# EasyEDA schematic 1-Schematic_1-Optimised-IRT-Gr4-ColleJoulian.json
TITLE: Ethernet-RJ45-tester; REV: 1.0; Date: 2023-11-09; Sheet: 1/1; Drawn By: collejoulian; Company: HEH
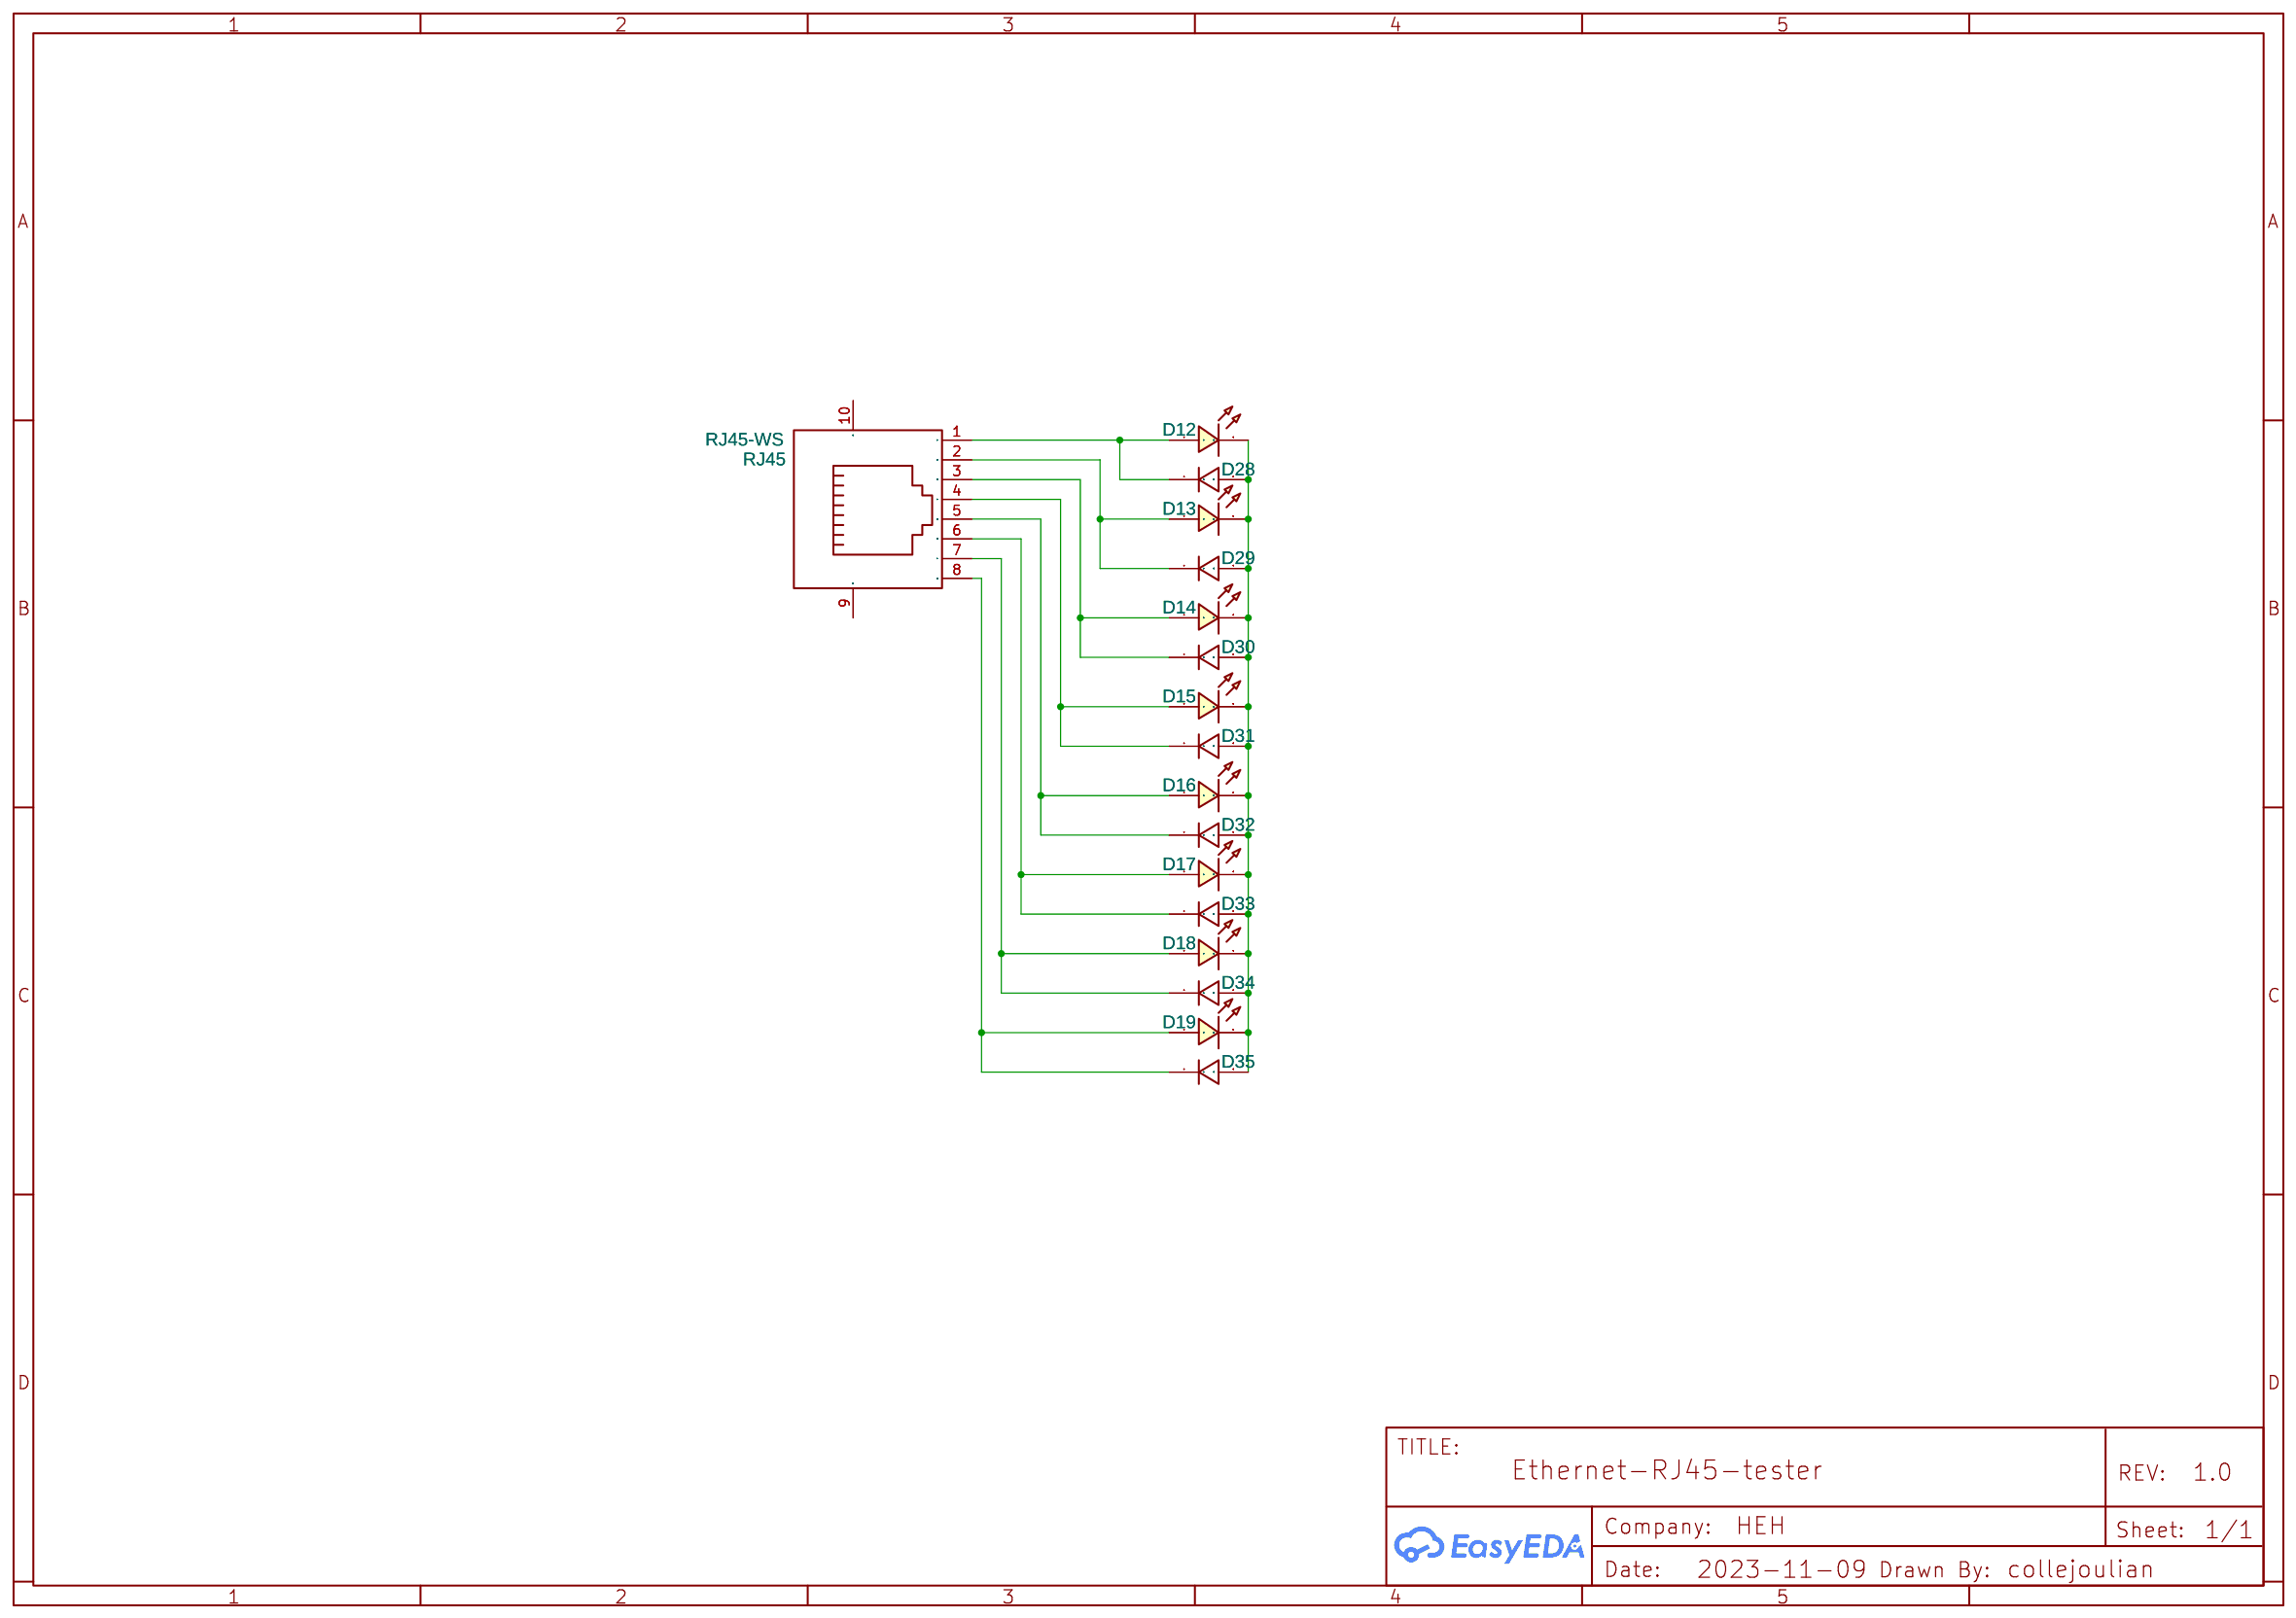
[diagram p0: schematic sheet]

## Parts
D12  D12  [LED-TH_BD3.0_RED]
D13  D13  [LED-TH_BD3.0_RED]
D14  D14  [LED-TH_BD3.0_RED]
D15  D15  [LED-TH_BD3.0_RED]
D16  D16  [LED-TH_BD3.0_RED]
D17  D17  [LED-TH_BD3.0_RED]
D18  D18  [LED-TH_BD3.0_RED]
D19  D19  [LED-TH_BD3.0_RED]
D28  D28  [DO-35_BD2.0-L4.2-P8.20-D0.5-RD]
D29  D29  [DO-35_BD2.0-L4.2-P8.20-D0.5-RD]
D30  D30  [DO-35_BD2.0-L4.2-P8.20-D0.5-RD]
D31  D31  [DO-35_BD2.0-L4.2-P8.20-D0.5-RD]
D32  D32  [DO-35_BD2.0-L4.2-P8.20-D0.5-RD]
D33  D33  [DO-35_BD2.0-L4.2-P8.20-D0.5-RD]
D34  D34  [DO-35_BD2.0-L4.2-P8.20-D0.5-RD]
D35  D35  [DO-35_BD2.0-L4.2-P8.20-D0.5-RD]
RJ45  RJ45-WS  [RJ45-TH_FRJ45004-1100K6K02C0]

## Library data of the parts
D12-D19 = LED-TH-3mm_R: Manufacturer: EVERLIGHT(台湾亿光); Manufacturer Part: 204-10SDRD/S530-A3-L; Supplier Part: C84774; Supplier: LCSC; Contributor: LCEDA_Lib
D28-D35 = 1N4148: Supplier: LCSC; Supplier Part: C13769; Manufacturer: STMicroelectronics; Contributor: LCSC
RJ45 = FRJ45004-1100K6K02C0: Contributor: LCSC; Supplier: LCSC; Supplier Part: C456366; Manufacturer: TXGA(特思嘉); JLCPCB Part Class: Extended Part; link: https://lcsc.com/eda_search?q=C456366&%26type=1&ref=editor

## Nets
Net-(D12-1): D12.1 D28.1 RJ45.1
Net-(D12-2): D12.2 D13.2 D14.2 D15.2 D16.2 D17.2 D18.2 D19.2 D28.2 D29.2 D30.2 D31.2 D32.2 D33.2 D34.2 D35.2
Net-(D13-1): D13.1 D29.1 RJ45.2
Net-(D14-1): D14.1 D30.1 RJ45.3
Net-(D15-1): D15.1 D31.1 RJ45.4
Net-(D16-1): D16.1 D32.1 RJ45.5
Net-(D17-1): D17.1 D33.1 RJ45.6
Net-(D18-1): D18.1 D34.1 RJ45.7
Net-(D19-1): D19.1 D35.1 RJ45.8

Not connected (* = marked no-connect by the designer): RJ45 9(EH) 10(EH)
